# Altium schematic sheet 03.SchDoc
size 386 x 246 mm
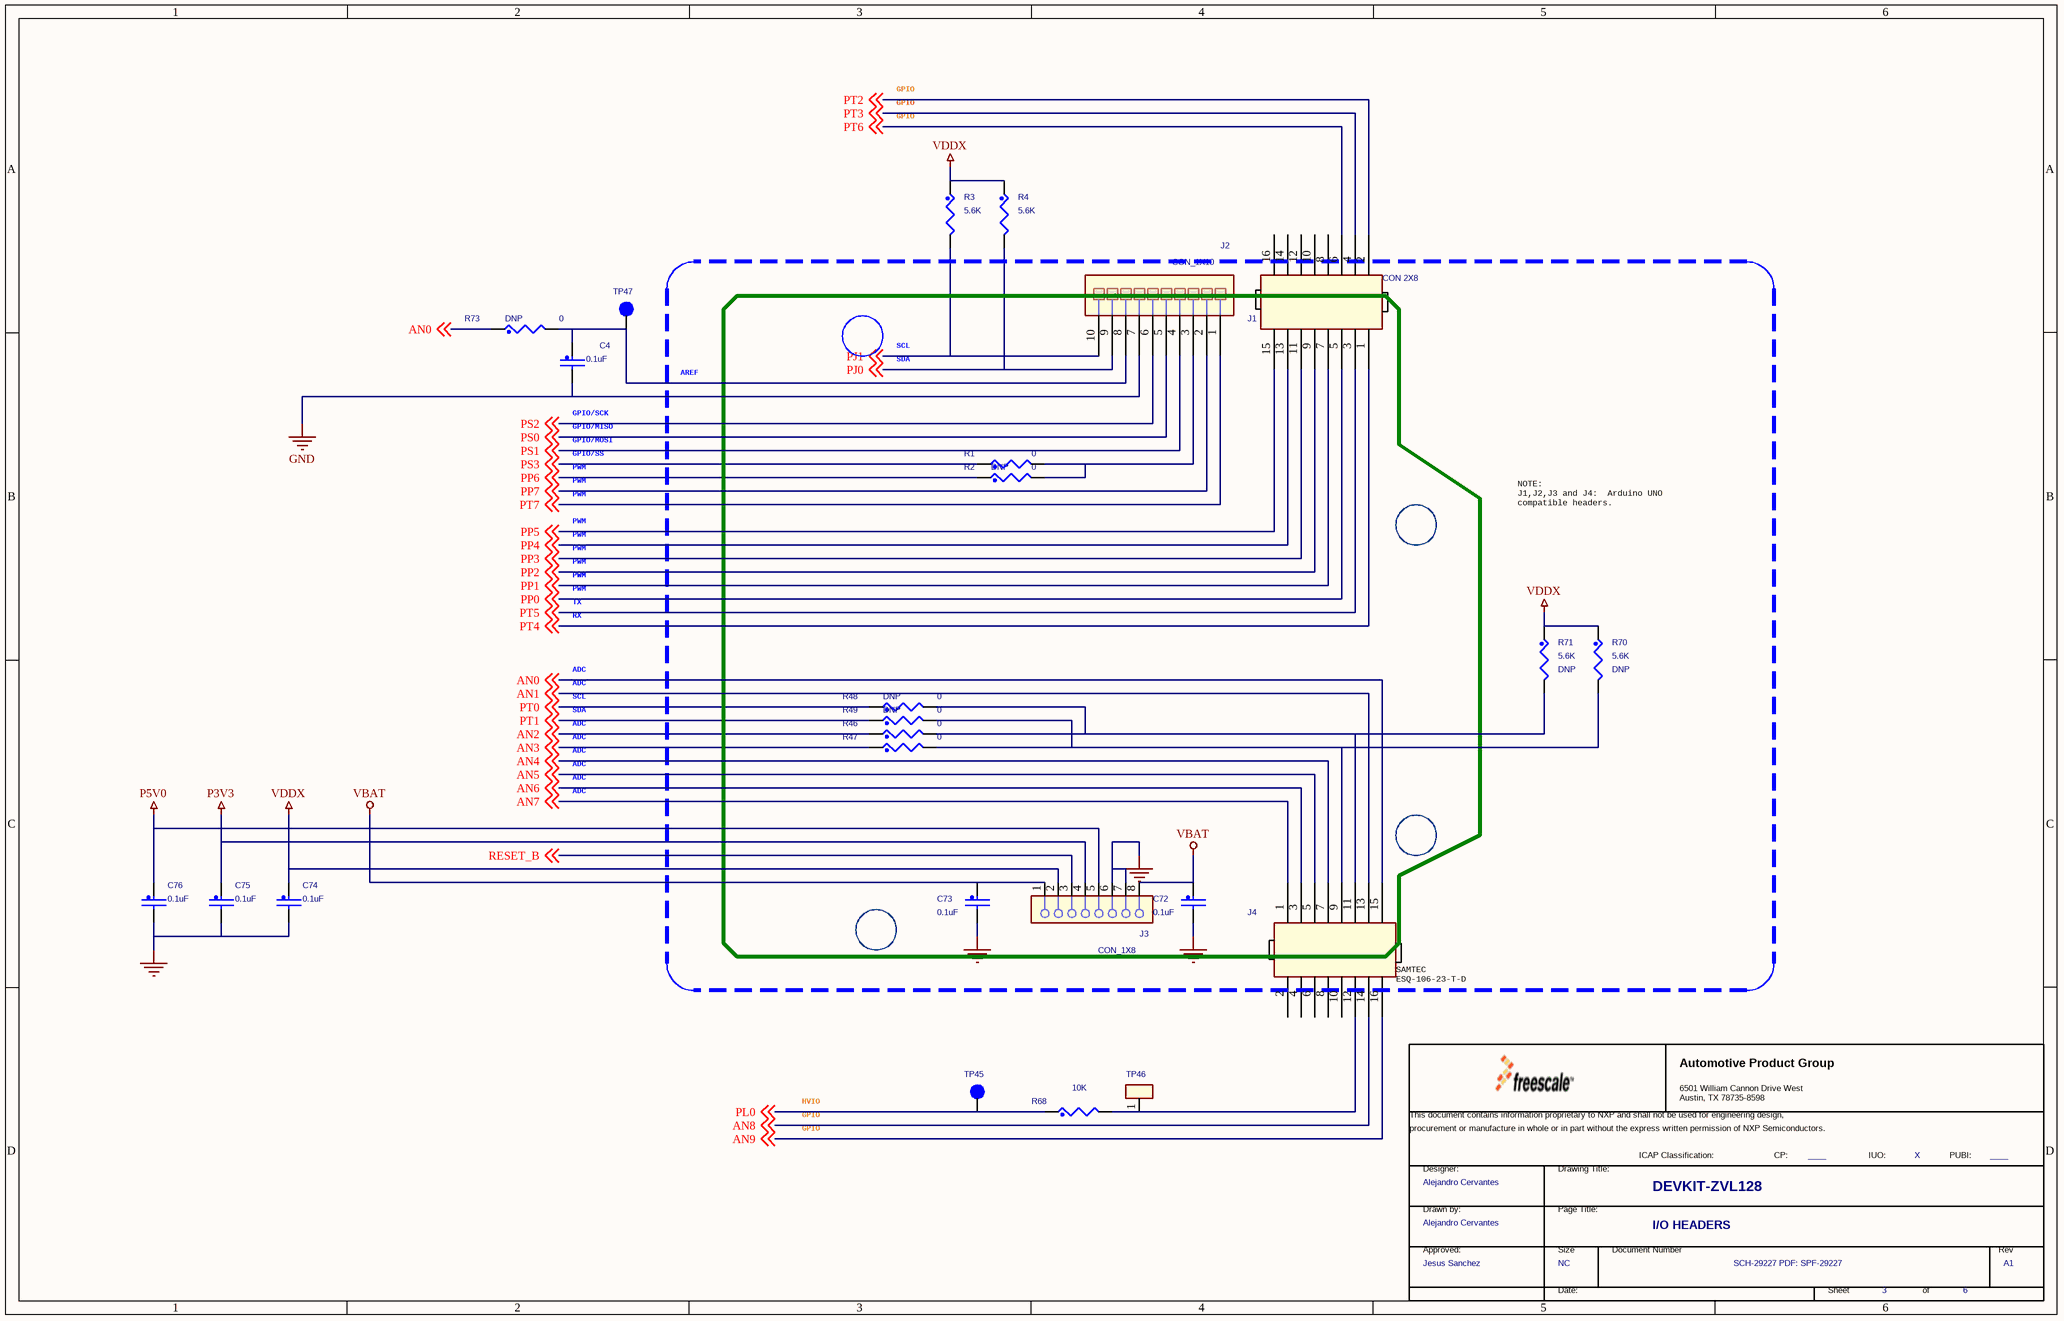
[diagram p0: 03.SchDoc]

## Parts
*  FCP: ____  FIUO: X  DrawnBy: Alejandro Cervantes  Approver: Jesus Sanchez  PageTitle: I/O HEADERS  Page Count: 6  Page Number: 3  Page Size: NC  Title: DEVKIT-ZVL128  RevCode: A1  Doc: SCH-29227 PDF: SPF-29227  (hidden comment: TitleBlock_AMPG)  (graphical)
C4  0.1uF  [CC0402_25]
C72  0.1uF  [CC0402_25]
C73  0.1uF  [CC0402_25]
C74  0.1uF  [CC0402_25]
C75  0.1uF  [CC0402_25]
C76  0.1uF  [CC0402_25]
J1  CON 2X8  [con_skt2x8_th]
J2  CON_1X10  [HDR110]
J3  CON_1X8  [con_1x8_skt_2p54_th]
J4  CON 2X8  [con_skt2x8_th]  (value not drawn)
R1  0  [RC0402_25]
R2  0  ASSY_OPT: DNP  [RC0402_25]
R3  5.6K  [RC0603_OV]
R4  5.6K  [RC0603_OV]
R46  0  [RC0402_25]
R47  0  [RC0402_25]
R48  0  ASSY_OPT: DNP  [RC0402_25]
R49  0  ASSY_OPT: DNP  [RC0402_25]
R68  10K  [RC0603_OV]
R70  5.6K  ASSY_OPT: DNP  [RC0603_OV]
R71  5.6K  ASSY_OPT: DNP  [RC0603_OV]
R73  0  ASSY_OPT: DNP  [RC0402_25]
TP45  TPAD_030  [TPAD_030]  (value not drawn)
TP46  TESTLOOP  [testpoint_135_070mil]  (value not drawn)
TP47  TPAD_030  [TPAD_030]  (value not drawn)

## Nets
GND: C4.2 C72.2 C73.2 C74.2 C75.2 C76.2 J2.7 J3.6 J3.7
P3V3: C75.1 J3.4
P5V0: C76.1 J3.5
VBAT: C72.1 C73.1 J3.1 J3.8
VDDX: C74.1 J3.2 R3.1 R4.1 R70.1 R71.1
AN0: J4.15 R73.1 ; off-sheet AN0
AN1: J4.13 ; off-sheet AN1
AN2: R46.1 ; off-sheet AN2
AN3: R47.1 ; off-sheet AN3
AN4: J4.7 ; off-sheet AN4
AN5: J4.5 ; off-sheet AN5
AN6: J4.3 ; off-sheet AN6
AN7: J4.1 ; off-sheet AN7
AN8: J4.14 ; off-sheet AN8
AN9: J4.16 ; off-sheet AN9
PJ0: J2.9 R4.2 ; off-sheet PJ0
PJ1: J2.10 R3.2 ; off-sheet PJ1
PL0: R68.1 TP45.1(Pin1) ; off-sheet PL0
PP0: J1.5 ; off-sheet PP0
PP1: J1.7 ; off-sheet PP1
PP2: J1.9 ; off-sheet PP2
PP3: J1.11 ; off-sheet PP3
PP4: J1.13 ; off-sheet PP4
PP5: J1.15 ; off-sheet PP5
PP6: R2.1 ; off-sheet PP6
PP7: J2.2 ; off-sheet PP7
PS0: J2.5 ; off-sheet PS0
PS1: J2.4 ; off-sheet PS1
PS2: J2.6 ; off-sheet PS2
PS3: R1.1 ; off-sheet PS3
PT0: R48.1 ; off-sheet PT0
PT1: R49.1 ; off-sheet PT1
PT2: J1.2 ; off-sheet PT2
PT3: J1.4 ; off-sheet PT3
PT4: J1.1 ; off-sheet PT4
PT5: J1.3 ; off-sheet PT5
PT6: J1.6 ; off-sheet PT6
PT7: J2.1 ; off-sheet PT7
RESET_B: J3.3 ; off-sheet RESET_B
NetC4_1: C4.1 J2.8 R73.2 TP47.1(Pin1)
NetJ2_3: J2.3 R1.2 R2.2
NetJ4_9: J4.9 R47.2 R49.2 R70.2
NetJ4_11: J4.11 R46.2 R48.2 R71.2
NetJ4_12: J4.12 R68.2 TP46.1

Not connected (* = marked no-connect by the designer): J1 8 10 12 14 16; J4 2 4 6 8 10

## Notes on the sheet
- GPIO
- AREF
- SCL
- SDA
- GPIO/SS
- GPIO/MOSI
- GPIO/MISO
- (near C4) GPIO/SCK
- PWM
- NOTE:
  J1,J2,J3 and J4:  Arduino UNO
  compatible headers.
- RX
- TX
- ADC
- (near J4) SAMTEC
  ESQ-106-23-T-D
- HVIO
- (in symbol TitleBlock_AMPG) Automotive Product Group; 6501 William Cannon Drive West / Austin, TX 78735-8598; This document contains information proprietary to NXP and shall not be used for engineering design,; procurement or manufacture in whole or in part without the express written permission of NXP Semiconductors.; ICAP Classification:; CP:; IUO:; PUBI:; Designer:; Drawing Title:; Drawn by:; Page Title:; Approved:; Size; Document Number; Rev; Date:; Sheet; of

## Library data of the parts
* = TitleBlock_AMPG: OrgAddr2: Austin, TX 78735-8598; OrgAddr1: 6501 William Cannon Drive West; OrgName: Freescale Semiconductor; PUBI: ____; Designer: Alejandro Cervantes; Page Create Date: March  8, 1995
C4 C72 C73 = CAP_NP: CAP CER 0.1uF 50V 10% X7R 0402; CLASS: DISCRETE; FPLIST: CC0402_25,CC0402_HD,0402_CC; CAD_APPROVED: Yes; MFG_PN01: GRM155R71H104KE14D; MFG_NAME01: MURATA; AGILE_PN: 150-79069; HEIGHT: 0.55MM; ROHS: Yes; Tolerance: 10%; VOLTAGE: 50V
C74-C76 = CAP_NP: CAP CER 0.1uF 50V 10% X7R 0402; CLASS: DISCRETE; AGILE_PN: 150-79069; MFG_NAME01: MURATA; MFG_PN01: GRM155R71H104KE14D; CAD_APPROVED: Yes; FPLIST: CC0402_25,CC0402_HD,0402_CC; Tolerance: 10%; ROHS: Yes; HEIGHT: 0.55MM; VOLTAGE: 50V
J1 J4 = HDR_2X8_M: CON 2X8 SKT TH 100MIL SP 335H AU 104L; CLASS: IO; CAD_APPROVED: Yes; MFG_PN01: SSW-108-01-S-D; MFG_NAME01: SAMTEC; AGILE_PN: 210-80983; HEIGHT: 8.76MM; ROHS: Yes
J2 = RCPT 1X10: CON 1X10 SKT TH 100MIL SP 335H AU; AGILE_PN: 210-75438; MFG_NAME01: SAMTEC; MFG_PN01: SSW-110-01-G-S; CAD_APPROVED: Yes; ROHS: Yes; HEIGHT: 8.51 MM
J3 = CONN_HDR_8X1: CON 1X8 SKT TH 100MIL SP 335H AU 104L; CLASS: IO; CAD_APPROVED: Yes; MFG_PN01: SSW-108-01-G-S; MFG_NAME01: SAMTEC; AGILE_PN: 210-79539; HEIGHT: 8.51MM; ROHS: Yes
R1 R2 R46 R47 R49 R73 = RES: RES MF ZERO OHM 1/16W -- AEC-Q200 0402; CLASS: DISCRETE; AGILE_PN: 470-80742; MFG_NAME01: VISHAY INTERTECHNOLOGY; MFG_PN01: CRCW04020000Z0ED; CAD_APPROVED: Yes; FPLIST: RC0402_25,RC0402_HD,0402_CC; ROHS: Yes; HEIGHT: 0.45 MM
R3 R4 R70 R71 = RES: RES MF 5.6K 1/10W 1% 0603; CLASS: DISCRETE; FPLIST: RC0603_OV,RC0603,0603_CC; CAD_APPROVED: Yes; MFG_PN01: RK73H1JTTD5601F; MFG_NAME01: KOA SPEER; AGILE_PN: 470-78026; HEIGHT: 0.55MM; ROHS: Yes; Tolerance: 1%
R48 = RES: RES MF ZERO OHM 1/16W -- AEC-Q200 0402; CLASS: DISCRETE; FPLIST: RC0402_25,RC0402_HD,0402_CC; CAD_APPROVED: Yes; MFG_PN01: CRCW04020000Z0ED; MFG_NAME01: VISHAY INTERTECHNOLOGY; AGILE_PN: 470-80742; HEIGHT: 0.45 MM; ROHS: Yes
R68 = RES: RES MF 10K 1/10W 5% 0603; CLASS: DISCRETE; FPLIST: RC0603_OV,RC0603,0603_CC; CAD_APPROVED: Yes; MFG_PN01: RK73B1JTTD103J; MFG_NAME01: KOA SPEER; AGILE_PN: 470-75410; HEIGHT: 0.55MM; ROHS: Yes; Tolerance: 5%
TP45 TP47 = TestLoop: TEST POINT PAD 30MIL DIA SMT, NO PART TO ORDER; CLASS: IO; AGILE_PN: 211-76642; MFG_NAME01: NOTACOMPONENT; CAD_APPROVED: Yes; MFG_PN01: NOTACOMPONENT; ROHS: Yes; HEIGHT: 0.1MM
TP46 = TEST_POINT: TEST POINT PAD SIZE 3.4MM X 1.8MM SMT; CLASS: IC; AGILE_PN: 211-75906; MFG_NAME01: KEYSTONE ELECTRONICS; MFG_PN01: 5015; CAD_APPROVED: Yes; PRIORITY_PN: 922-00014; ROHS: Yes; HEIGHT: 1.53 MM